# Altium schematic sheet CTR_UVOV.SchDoc: Power Input
size A4; DrawnBy: Andrei Divinagracia; Revision: 0A; SheetNumber: 3; SheetTotal: 10
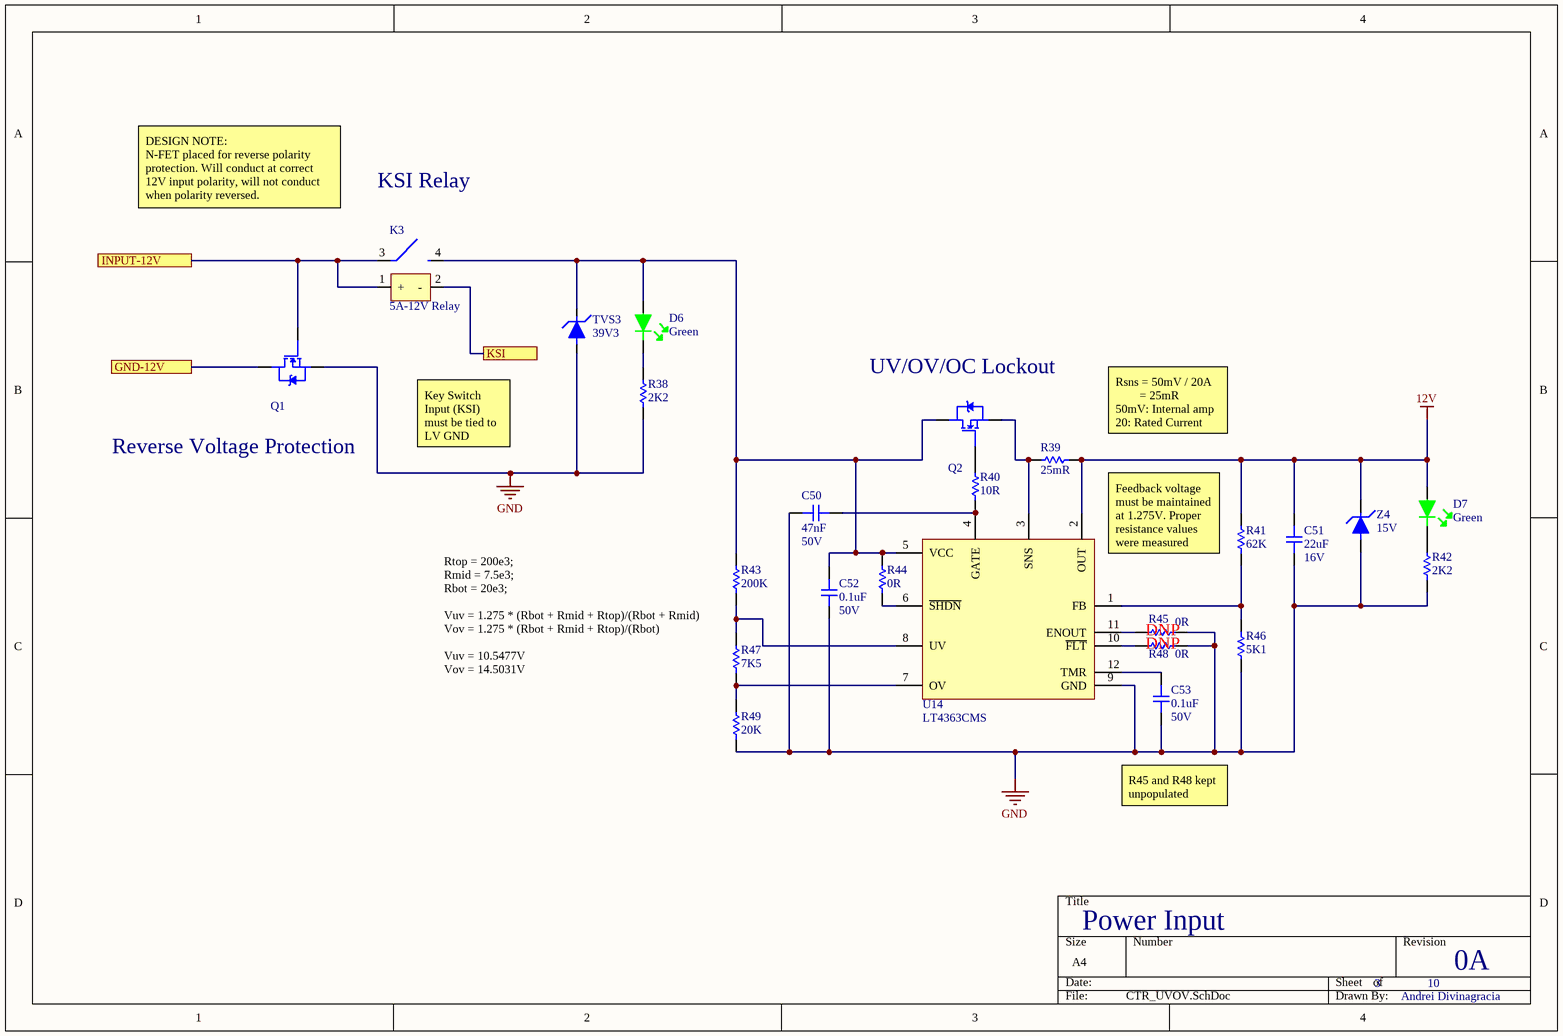
[diagram p0: CTR_UVOV.SchDoc]

## Parts
C50  47nF  Voltage: 50V  [CAP-0805]
C51  22uF  Voltage Rating: 16V  [CAP-0805]
C52  0.1uF  Voltage Rating: 50V  [CAP-0603]
C53  0.1uF  Voltage Rating: 50V  [CAP-0603]
D6  Green  [LED-0603]
D7  Green  [LED-0603]
K3  5A-12V Relay  [Relay]
Q1  DMN6040SK3-13  [TO-252-3]  (value not drawn)
Q2  DMN6040SK3-13  [TO-252-3]  (value not drawn)
R38  2K2  [RES-0603]
R39  25mR  [RES-2512]
R40  10R  [RES-0603]
R41  62K  [RES-0603]
R42  2K2  [RES-0603]
R43  200K  [RES-0603]
R44  0R  [RES-0603]
R45  0R  [RES-0603]
R46  5K1  [RES-0603]
R47  7K5  [RES-0603]
R48  0R  [RES-0603]
R49  20K  [RES-0603]
TVS3  39V3  [DO-214AC]
U14  LT4363CMS  [SSOP12-UVOV]
Z4  15V  [DO-214AC]

## Ports
GND-12V, INPUT-12V, KSI

## Nets
12V: C51.2 D7.1 R39.1 R41.2 U14.2(OUT) Z4.1
GND: C50.1 C51.1 C52.1 C53.1 Q1.3(S) R38.1 R42.1 R45.1 R46.2 R48.1 R49.1 TVS3.2 U14.9(GND) Z4.2
GND-12V: Q1.2(D) ; port GND-12V
INPUT-12V: K3.1(+) K3.3 Q1.1(G) ; port INPUT-12V
KSI: K3.2(-) ; port KSI
NetC50_2: C50.2 R40.1 U14.4(GATE)
NetC52_2: C52.2 D6.1 K3.4 Q2.2(D) R43.2 R44.2 TVS3.1 U14.5(VCC)
NetC53_2: C53.2 U14.12(TMR)
NetD6_2: D6.2 R38.2
NetD7_2: D7.2 R42.2
NetQ2_1: Q2.1(G) R40.2
NetQ2_3: Q2.3(S) R39.2 U14.3(SNS)
NetR41_1: R41.1 R46.1 U14.1(FB)
NetR43_1: R43.1 R47.2 U14.8(UV)
NetR44_1: R44.1 U14.6(~{SHDN})
NetR45_2: R45.2 U14.11(ENOUT)
NetR47_1: R47.1 R49.2 U14.7(OV)
NetR48_2: R48.2 U14.10(~{FLT})

## Notes on the sheet
- DESIGN NOTE:
  N-FET placed for reverse polarity protection. Will conduct at correct 12V input polarity, will not conduct when polarity reversed.
- KSI Relay
- (near Q2) UV/OV/OC Lockout
- Key Switch Input (KSI) must be tied to LV GND
- (near R39) Rsns = 50mV / 20A
  = 25mR
  50mV: Internal amp
  20: Rated Current
- Reverse Voltage Protection
- Feedback voltage must be maintained at 1.275V. Proper resistance values were measured
- (near R45) DNP
- DNP
- Rtop = 200e3;
  Rmid = 7.5e3;
  Rbot = 20e3;
  Vuv = 1.275 * (Rbot + Rmid + Rtop)/(Rbot + Rmid)
  Vov = 1.275 * (Rbot + Rmid + Rtop)/(Rbot)
  Vuv = 10.5477V
  Vov = 14.5031V
- (near C53) R45 and R48 kept unpopulated

## Library data of the parts
C50 = 0805-47nF-50V: CAP CER 0.047UF 50V X7R 0805; Manufacturer: Yageo; Manufacturer Part Number: CC0805KRX7R9BB473; Material: Ceramic; Tolerance: 10%; Insulation Resistance: 100GR; Dissipation Factor: 2.5%; Supplier 1: Digi-Key; Stock 1: 16938; Pricing 1: 1=0.14, 10=0.1, 100=0.047, 500=0.03298, 1000=0.0273 (USD); Mount: Surface Mount; Case/Package: 0805; Number of Pins: 2; Case Code (Metric): 2012; Case Code (Imperial): 0805; Dielectric Material: Ceramic; Min Operating Temperature: -55°C; Max Operating Temperature: 125°C; Packaging: Tape and Reel; Capacitance: 47nF; Voltage Rating: 50V; Package Quantity: 1; Voltage Rating (DC): 50V; Dielectric: X7R; Termination: SMD/SMT; Composition: Ceramic; Length: 2mm; Height: 1.25mm; Width: 1.25mm; Thickness: 0.037inch; Depth: 1.25mm; Radiation Hardening: No; REACH SVHC: Unknown; Lead Free: Lead Free; Halogen Free: Halogen Free; ComponentLink1URL: http://www.yageo.com/documents/recent/UPY-GPHC_X7R_6.3V-to-50V_18.pdf?src-supplier=Digi-Key; ComponentLink1Description: http://www.yageo.com/documents/recent/UPY-GPHC_X7R_6.3V-to-50V_18.pdf?src-supplier=Digi-Key; ComponentLink2URL: http://www.farnell.com/datasheets/2167236.pdf?src-supplier=Element14; ComponentLink2Description: http://www.farnell.com/datasheets/2167236.pdf?src-supplier=Element14; ComponentLink3URL: http://www.farnell.com/datasheets/1489800.pdf?src-supplier=Element14; ComponentLink3Description: http://www.farnell.com/datasheets/1489800.pdf?src-supplier=Element14; ComponentLink4URL: http://www.yageo.com/documents/recent/UPY-GPHC_X7R_6.3V-to-50V_8.pdf?src-supplier=Avnet; ComponentLink4Description: http://www.yageo.com/documents/recent/UPY-GPHC_X7R_6.3V-to-50V_8.pdf?src-supplier=Avnet; ComponentLink5URL: https://www.verical.com/server-webapp/html/getDatasheet?partID=403708&src-supplier=Verical; ComponentLink5Description: https://www.verical.com/server-webapp/html/getDatasheet?partID=403708&src-supplier=Verical; Supplier Part Number 1: 311-1431-6-ND
C51 = CL21A226KOQNNNE: CAP CER 22UF 16V X5R 0805; Manufacturer: Samsung; Tolerance: 10%; Supplier 1: Digi-Key; Manufacturer Part Number: CL21A226KOQNNNE; Stock 1: 761343; Pricing 1: 1=0.37, 10=0.258, 50=0.1804, 100=0.1546, 500=0.11592, 1000=0.09789 (USD); Mount: Surface Mount; Case/Package: 0805; Case Code (Metric): 2012; Case Code (Imperial): 0805; Min Operating Temperature: -55°C; Max Operating Temperature: 85°C; Packaging: Tape and Reel; Capacitance: 22uF; Voltage Rating (DC): 16V; Length: 0.079inch; Width: 0.049inch; Thickness: 0.055inch; Lead Free: Lead Free; RoHS Compliant: Yes; ComponentLink1URL: http://www.samsungsem.com/kr/support/library/product-catalog/mlcc.jsp?src-supplier=Digi-Key; ComponentLink1Description: http://www.samsungsem.com/kr/support/library/product-catalog/mlcc.jsp?src-supplier=Digi-Key; Supplier Part Number 1: 1276-6526-6-ND
C52 C53 = 0603-0.1uF-50V: CAP CER 0.1UF 50V X7R 0603; Manufacturer: Samsung; Manufacturer Part Number: CL10B104KB8NNNL; Capacitance: 100nF; Tolerance: 10%; Supplier 1: Digi-Key; Stock 1: 1355979; Pricing 1: 1=0.1, 10=0.03, 50=0.0164, 100=0.0134, 500=0.00958, 1000=0.00753, 2500=0.00684, 5000=0.0063 (USD); Mount: Surface Mount; Case/Package: 0603; Min Operating Temperature: -55°C; Max Operating Temperature: 125°C; Packaging: Tape and Reel; Package Quantity: 15000; Dielectric: X7R; Voltage Rating (DC): 50V; Series: CL; Construction: Flat; Length: 1.6mm; Width: 0.031inch; Height: 0.8mm; Thickness: 0.035inch; Depth: 0.8mm; Radiation Hardening: No; RoHS Compliant: Yes; ComponentLink1URL: https://www.verical.com/server-webapp/html/getDatasheet?partID=357523&src-supplier=Verical; ComponentLink1Description: https://www.verical.com/server-webapp/html/getDatasheet?partID=357523&src-supplier=Verical; ComponentLink2URL: https://media.digikey.com/pdf/Data%20Sheets/Samsung%20PDFs/CL_Series_MLCC_ds.pdf?src-supplier=Digi-Key; ComponentLink2Description: https://media.digikey.com/pdf/Data%20Sheets/Samsung%20PDFs/CL_Series_MLCC_ds.pdf?src-supplier=Digi-Key; Supplier Part Number 1: 1276-CL10B104KB8NNNLCT-ND
D6 D7 = LED-Green: LED GREEN CLEAR 0603 SMD; Manufacturer: Wurth Electronics; Manufacturer Part Number: 150060VS75000; Luminous Intensity: 40mcd; Viewing Angle: 140°; Forward Voltage: 2V; Wavelength: 570nm; Lens Style: Clear,Rectangular; Forward Current: 30mA; Test Current: 20mA; Supplier 1: Digi-Key; Stock 1: 118118; Pricing 1: 1=0.14, 50=0.133, 100=0.114, 500=0.099 (USD); Mount: Surface Mount; Case/Package: 0603; Number of Pins: 2; Color: Green; Case Code (Metric): 1608; Case Code (Imperial): 0603; Min Operating Temperature: -40°C; Max Operating Temperature: 85°C; Package Quantity: 1; Packaging: Tape and Reel; Dominant Wavelength: 570nm; Length: 1.6mm; Height: 0.7mm; Width: 0.8mm; REACH SVHC: Unknown; ComponentLink1URL: https://katalog.we-online.de/led/datasheet/150060VS75000.pdf?src-supplier=Digi-Key; ComponentLink1Description: https://katalog.we-online.de/led/datasheet/150060VS75000.pdf?src-supplier=Digi-Key; Supplier Part Number 1: 732-4980-1-ND
K3 = OJE-SH-112DM,000: General Purpose Relay SPST-NO (1 Form A) 12VDC Coil Through Hole; Manufacturer: TE Connectivity; Contact Current Rating: 5A; Coil Current: 37.5mA; Throw Configuration: SPST; Operate Time: 10ms; Release Time: 4ms; Coil Power: 500mW; Coil Resistance: 320R; Coil Type: Non-Latching; Coil Voltage (DC): 12V; Contact Voltage Rating (DC): 30V; Max Voltage Rating (AC): 265V; Supplier 1: Digi-Key; Manufacturer Part Number: OJE-SH-112DM,000; Stock 1: 912; Pricing 1: 1=1.18, 10=1.105, 25=0.9824, 50=0.9334, 100=0.8843, 250=0.78608, 500=0.73696, 1000=0.68782, 5000=0.66326 (USD); Mount: Through Hole; Number of Pins: 4; Contact Material: Silver; Weight: 9g; Min Operating Temperature: -30°C; Max Operating Temperature: 85°C; Package Quantity: 100; Packaging: Tray; Termination: PCB; Relay Type: General Purpose; Series: OJE, OEG; Max Voltage Rating (DC): 30V; Length: 0.717inch; Width: 0.4inch; Height: 14.7mm; RoHS Compliant: Yes; REACH SVHC: Unknown; Lead Free: Lead Free; ComponentLink1URL: http://www.farnell.com/datasheets/1846831.pdf?src-supplier=Farnell; ComponentLink1Description: http://www.farnell.com/datasheets/1846831.pdf?src-supplier=Farnell; ComponentLink2URL: http://www.onlinecomponents.com/productFiles/mf-PB/ojojeseries.pdf?src-supplier=Onlinecomponents.com; ComponentLink2Description: http://www.onlinecomponents.com/productFiles/mf-PB/ojojeseries.pdf?src-supplier=Onlinecomponents.com; Supplier Part Number 1: PB875-ND
Q1 Q2 = DMN6040SK3-13: MOSFET N CH 60V 20A TO252; Manufacturer: Diodes; Input Capacitance: 1.287nF; Max Power Dissipation: 42W; Rise Time: 8.1ns; Rds On Max: 40mR; Number of Channels: 1; Drain to Source Resistance: 30mR; Turn-On Delay Time: 6.6ns; Turn-Off Delay Time: 20.1ns; Fall Time: 4ns; Element Configuration: Single; Gate to Source Voltage (Vgs): 20V; FET Type: 1 N-Channel; Polarity: N-CHANNEL; Supplier 1: Digi-Key; Manufacturer Part Number: DMN6040SK3-13; Stock 1: 2500; Pricing 1: 1=0.67, 10=0.573, 25=0.5344, 100=0.4275, 500=0.3359, 1000=0.25956 (USD); Mount: Surface Mount; Case/Package: TO-252-3; Number of Pins: 3; Weight: 0.139332oz; Min Operating Temperature: -55°C; Max Operating Temperature: 150°C; Packaging: Tape and Reel; Package Quantity: 2500; Drain to Source Voltage (Vdss): 60V; Continuous Drain Current (ID): 20A; Series: -; Length: 6.7mm; Width: 6.2mm; Height: 2.39mm; Radiation Hardening: No; REACH SVHC: No SVHC; Lead Free: Lead Free; RoHS Compliant: Yes; ComponentLink1URL: http://www.mouser.com/ds/2/115/DMN6040SK3-247263.pdf?src-supplier=Mouser; ComponentLink1Description: http://www.mouser.com/ds/2/115/DMN6040SK3-247263.pdf?src-supplier=Mouser; ComponentLink2URL: http://uk.rs-online.com/webdocs/1268/0900766b81268cd0.pdf?src-supplier=RSComponents; ComponentLink2Description: http://uk.rs-online.com/webdocs/1268/0900766b81268cd0.pdf?src-supplier=RSComponents; ComponentLink3URL: http://www.diodes.com/datasheets/DMN6040SK3.pdf?src-supplier=Avnet; ComponentLink3Description: http://www.diodes.com/datasheets/DMN6040SK3.pdf?src-supplier=Avnet; ComponentLink4URL: https://www.diodes.com/assets/Datasheets/DMN6040SK3.pdf?src-supplier=Digi-Key; ComponentLink4Description: https://www.diodes.com/assets/Datasheets/DMN6040SK3.pdf?src-supplier=Digi-Key; Supplier Part Number 1: DMN6040SK3-13DICT-ND
R38 R42 = 0603-2K2: RES SMD 2.2K OHM 5% 1/10W 0603; Manufacturer: Yageo; Manufacturer Part Number: AC0603JR-072K2L; Resistance: 2.2kR; Power Rating: 100mW; Voltage Rating: 50V; Temperature Coefficient: 100ppm/°C; Supplier 1: Digi-Key; Stock 1: 107229; Pricing 1: 1=0.1, 10=0.024, 100=0.0097, 1000=0.00436, 2500=0.00378 (USD); Case/Package: 0603; Case Code (Imperial): 0603; Case Code (Metric): 1608; Contact Plating: Tin,Matte; Min Operating Temperature: -55°C; Max Operating Temperature: 155°C; Tolerance: 5%; Packaging: Tape and Reel; Resistor Type: Thick Film; Termination: SMD/SMT; Number of Terminations: 2; Max Power Dissipation: 100mW; Features: Moisture Resistant,Automotive AEC-Q200; Series: AC; Length: 0.063inch; Width: 0.8mm; Height: 0.022inch; Radiation Hardening: No; Lead Free: Lead Free; RoHS Compliant: Yes; ComponentLink1URL: http://www.mouser.com/ds/2/447/yageodocoutput-1111992.pdf?src-supplier=Mouser; ComponentLink1Description: http://www.mouser.com/ds/2/447/yageodocoutput-1111992.pdf?src-supplier=Mouser; ComponentLink2URL: http://www.yageo.com/documents/recent/PYu-AC_51_RoHS_L_2_revised.pdf?src-supplier=Avnet+Europe; ComponentLink2Description: http://www.yageo.com/documents/recent/PYu-AC_51_RoHS_L_2_revised.pdf?src-supplier=Avnet+Europe; ComponentLink3URL: http://www.yageo.com/NewPortal/yageodocoutput?fileName=/pdf/R-Chip/PYu-AC_51_RoHS_L_6.pdf&src-supplier=Digi-Key; ComponentLink3Description: http://www.yageo.com/NewPortal/yageodocoutput?fileName=/pdf/R-Chip/PYu-AC_51_RoHS_L_6.pdf&src-supplier=Digi-Key; ComponentLink4URL: https://www.yageo.com/upload/media/product/productsearch/datasheet/rchip/PYu-AC_51_RoHS_L_7.pdf?src-supplier=Digi-Key; ComponentLink4Description: https://www.yageo.com/upload/media/product/productsearch/datasheet/rchip/PYu-AC_51_RoHS_L_7.pdf?src-supplier=Digi-Key; Supplier Part Number 1: YAG3657CT-ND
R39 = 2512-25mR-SHUNT: RES SMD 25 MOHM 1% 2W 2512; Manufacturer: Riedon; Manufacturer Part Number: CSR2512A0R025F; Temperature Coefficient: 50ppm/°C; Supplier 1: Digi-Key; Stock 1: 10830; Pricing 1: 1=0.63, 10=0.525, 25=0.45, 50=0.405, 100=0.3525, 250=0.315, 500=0.255, 1000=0.20625 (USD); Case/Package: 2512; Case Code (Metric): 6432; Case Code (Imperial): 2512; Min Operating Temperature: -55°C; Max Operating Temperature: 170°C; Packaging: Tape and Reel; Resistance: 25mR; Resistor Type: Metal Element; Number of Terminations: 2; Tolerance: 1%; Max Power Dissipation: 2W; Length: 0.252inch; Width: 0.126inch; Height: 0.035inch; ComponentLink1URL: https://riedon.com/media/pdf-tech/riedon_brochure_download.pdf?src-supplier=Digi-Key; ComponentLink1Description: https://riedon.com/media/pdf-tech/riedon_brochure_download.pdf?src-supplier=Digi-Key; ComponentLink2URL: https://riedon.com/media/pdf/CSR.pdf?src-supplier=Digi-Key; ComponentLink2Description: https://riedon.com/media/pdf/CSR.pdf?src-supplier=Digi-Key; Supplier Part Number 1: 696-1666-1-ND
R40 = 0603-10R: RES SMD 10 OHM 1% 1/10W 0603; Manufacturer: Yageo; Manufacturer Part Number: RC0603FR-0710RL; Voltage Rating (DC): 50V; Temperature Coefficient: 200ppm/°C; Power Rating: 100mW; Supplier 1: Digi-Key; Stock 1: 11151092; Pricing 1: 1=0.1, 10=0.046, 100=0.0187, 1000=0.0084, 2500=0.00729 (USD); Case/Package: 0603; Number of Pins: 2; Case Code (Imperial): 0603; Case Code (Metric): 1608; Contact Plating: Tin,Matte; Min Operating Temperature: -55°C; Max Operating Temperature: 155°C; Packaging: Tape and Reel; Resistance: 10R; Tolerance: 1%; Composition: Thick Film; Voltage Rating: 50V; Termination: SMD/SMT; Military Standard: Not; Length: 1.6mm; Height: 0.45mm; Width: 0.8mm; Depth: 0.8mm; Radiation Hardening: No; REACH SVHC: No SVHC; Lead Free: Lead Free; ComponentLink1URL: http://www.farnell.com/datasheets/1868787.pdf?src-supplier=Element14; ComponentLink1Description: http://www.farnell.com/datasheets/1868787.pdf?src-supplier=Element14; ComponentLink2URL: http://www.yageo.com/documents/recent/PYu-RC0603_51_RoHS_L_4.pdf?src-supplier=Avnet; ComponentLink2Description: http://www.yageo.com/documents/recent/PYu-RC0603_51_RoHS_L_4.pdf?src-supplier=Avnet; ComponentLink3URL: http://documents.rs-components.com/techlib://itc_doclist_GB.htm?stockno=5048984&src-supplier=RSComponents; ComponentLink3Description: http://documents.rs-components.com/techlib://itc_doclist_GB.htm?stockno=5048984&src-supplier=RSComponents; ComponentLink4URL: http://www.yageo.com/documents/recent/PYu-RC0603_51_RoHS_L_4.pdf?src-supplier=Avnet+Europe; ComponentLink4Description: http://www.yageo.com/documents/recent/PYu-RC0603_51_RoHS_L_4.pdf?src-supplier=Avnet+Europe; Supplier Part Number 1: 311-10.0HRDKR-ND
R41 = 0603-62K: RES SMD 62K OHM 1% 1/4W 0603; Manufacturer: Panasonic; Manufacturer Part Number: ERJ-PA3F6202V; Power Rating: 250mW; Resistance: 62kR; Voltage Rating: 150V; Temperature Coefficient: 100ppm/°C; Supplier 1: Digi-Key; Stock 1: 17832; Pricing 1: 1=0.15, 10=0.13, 100=0.05, 1000=0.02201, 2500=0.01901 (USD); Mount: Surface Mount; Case/Package: 0603; Case Code (Metric): 1608; Case Code (Imperial): 0603; Min Operating Temperature: -55°C; Max Operating Temperature: 155°C; Tolerance: 1%; Resistor Type: Thick Film; Packaging: Cut Tape; Number of Terminations: 2; Termination: Solder; Max Power Dissipation: 250mW; Voltage Rating (DC): 150V; Features: Automotive AEC-Q200; Length: 0.063inch; Width: 0.031inch; Height: 0.018inch; Depth: 0.8mm; REACH SVHC: No SVHC; ComponentLink1URL: http://www.farnell.com/datasheets/2059624.pdf?src-supplier=Farnell; ComponentLink1Description: http://www.farnell.com/datasheets/2059624.pdf?src-supplier=Farnell; ComponentLink2URL: http://www.farnell.com/datasheets/1801181.pdf?src-supplier=Element14; ComponentLink2Description: http://www.farnell.com/datasheets/1801181.pdf?src-supplier=Element14; Supplier Part Number 1: P62KBYCT-ND
R43 = 0603-200KR: RES SMD 200K OHM 1% 1/10W 0603; Manufacturer: Yageo; Manufacturer Part Number: AF0603FR-07200KL; Max Power Dissipation: 100mW; Temperature Coefficient: 100ppm/°C; Resistance: 200kR; Supplier 1: Digi-Key; Stock 1: 4721; Pricing 1: 1=0.1, 10=0.061, 100=0.0247, 1000=0.01109, 2500=0.00963 (USD); Case/Package: 0603; Min Operating Temperature: -55°C; Max Operating Temperature: 155°C; Packaging: Tape and Reel; Resistor Type: Thick Film; Number of Terminations: 2; Tolerance: 1%; Features: Moisture Resistant,Anti-Sulfur; Length: 0.063inch; Width: 0.031inch; Height: 0.022inch; RoHS Compliant: Yes; ComponentLink1URL: http://www.yageo.com/documents/recent/PYu-AF_51_RoHS_L_5.pdf?src-supplier=Digi-Key; ComponentLink1Description: http://www.yageo.com/documents/recent/PYu-AF_51_RoHS_L_5.pdf?src-supplier=Digi-Key; Supplier Part Number 1: 13-AF0603FR-07200KLDKR-ND
R44 R45 R48 = 0603-0R: RES SMD 0 OHM JUMPER 1/10W 0603; Manufacturer: Yageo; Manufacturer Part Number: RC0603JR-070RL; Resistance: 0mR; Tolerance: 1%; Voltage Rating: 50V; Power Rating: 100mW; Temperature Coefficient: 200ppm/°C; Supplier 1: Digi-Key; Stock 1: 25658294; Pricing 1: 1=0.1, 10=0.019, 25=0.0136, 50=0.0104, 100=0.0077, 250=0.00588, 500=0.00472, 1000=0.00347 (USD); Case/Package: 0603; Number of Pins: 2; Case Code (Imperial): 0603; Case Code (Metric): 1608; Contact Plating: Tin,Matte; Min Operating Temperature: -55°C; Max Operating Temperature: 155°C; Package Quantity: 5000; Packaging: Tape and Reel; Voltage Rating (DC): 50V; Termination: SMD/SMT; Composition: Thick Film; Military Standard: Not; Length: 1.6mm; Height: 0.45mm; Width: 0.8mm; Depth: 0.8mm; Radiation Hardening: No; REACH SVHC: No SVHC; Lead Free: Lead Free; ComponentLink1URL: http://www.farnell.com/datasheets/2167052.pdf?src-supplier=Element14; ComponentLink1Description: http://www.farnell.com/datasheets/2167052.pdf?src-supplier=Element14; ComponentLink2URL: https://www.verical.com/server-webapp/html/getDatasheet?partID=329462&src-supplier=Verical; ComponentLink2Description: https://www.verical.com/server-webapp/html/getDatasheet?partID=329462&src-supplier=Verical; ComponentLink3URL: http://www.yageo.com/documents/recent/PYu-RC_Group_51_RoHS_L_9.pdf?src-supplier=Mouser; ComponentLink3Description: http://www.yageo.com/documents/recent/PYu-RC_Group_51_RoHS_L_9.pdf?src-supplier=Mouser; ComponentLink4URL: http://www.farnell.com/datasheets/443971.pdf?src-supplier=Element14; ComponentLink4Description: http://www.farnell.com/datasheets/443971.pdf?src-supplier=Element14; ComponentLink5URL: http://documents.rs-components.com/techlib://itc_doclist_GB.htm?stockno=6515918&src-supplier=RSComponents; ComponentLink5Description: http://documents.rs-components.com/techlib://itc_doclist_GB.htm?stockno=6515918&src-supplier=RSComponents; Supplier Part Number 1: 311-0.0GRCT-ND
R46 = 0603-5.1KR: RES SMD 5.1K OHM 1% 1/10W 0603; Manufacturer: TE Connectivity; Manufacturer Part Number: 1623257-1; Resistance: 5.1kR; Power Rating: 125mW; Temperature Coefficient: 100ppm/°C; Mount: Surface Mount; Case/Package: 0805; Min Operating Temperature: -55°C; Max Operating Temperature: 125°C; Packaging: Tape and Reel; Tolerance: 1%; Package Quantity: 5000; Resistor Type: Thick Film; Number of Terminations: 2; Series: CRG, Neohm; Max Power Dissipation: 125mW; Construction: Rectangular; Length: 2mm; Width: 0.049inch; Height: 0.026inch; Depth: 1.25mm; Radiation Hardening: No; RoHS Compliant: Yes; Military Standard: Not; ComponentLink1URL: http://www.te.com/commerce/DocumentDelivery/DDEController?Action=showdoc&DocId=Data+Sheet%7F1773204%7FF%7Fpdf%7FEnglish%7FENG_DS_1773204_F.pdf&src-supplier=Avnet+Europe; ComponentLink1Description: http://www.te.com/commerce/DocumentDelivery/DDEController?Action=showdoc&DocId=Data+Sheet%7F1773204%7FF%7Fpdf%7FEnglish%7FENG_DS_1773204_F.pdf&src-supplier=Avnet+Europe; ComponentLink2URL: http://www.te.com/commerce/DocumentDelivery/DDEController?Action=srchrtrv&DocNm=1773204&DocType=DS&DocLang=English&src-supplier=Digi-Key; ComponentLink2Description: http://www.te.com/commerce/DocumentDelivery/DDEController?Action=srchrtrv&DocNm=1773204&DocType=DS&DocLang=English&src-supplier=Digi-Key; ComponentLink3URL: http://www.onlinecomponents.com/productFiles/mf-AMP/eng_ds_1773204_e.pdf?src-supplier=Onlinecomponents.com; ComponentLink3Description: http://www.onlinecomponents.com/productFiles/mf-AMP/eng_ds_1773204_e.pdf?src-supplier=Onlinecomponents.com; Supplier 1: Digi-Key; Supplier Part Number 1: YAG3621CT-ND
R47 = 0603-7K5: RES SMD 7.5K OHM 5% 1/10W 0603; Manufacturer: Yageo; Manufacturer Part Number: RC0603JR-077K5L; Resistance: 7.5kR; Power Rating: 100mW; Voltage Rating: 50V; Temperature Coefficient: 100ppm/°C; Supplier 1: Digi-Key; Stock 1: 191420; Pricing 1: 1=0.1, 10=0.02, 100=0.008, 1000=0.0036, 2500=0.00312 (USD); Case/Package: 0603; Number of Pins: 2; Case Code (Imperial): 0603; Case Code (Metric): 1608; Size Code: 0603; Min Operating Temperature: -55°C; Max Operating Temperature: 155°C; Tolerance: 5%; Packaging: Tape and Reel; Package Quantity: 5000; Termination: SMD/SMT; Resistor Type: Thick Film; Voltage Rating (DC): 50V; Features: Moisture Resistant; Series: RC; Max Power Dissipation: 100mW; Number of Terminations: 2; Construction: Rectangular; Resistance Tolerance: 5%; Length: 1.6mm; Width: 0.8mm; Height: 0.45mm; Depth: 0.8mm; Military Standard: Not; Lead Free: Lead Free; RoHS Compliant: Yes; REACH SVHC: Unknown; ComponentLink1URL: http://www.mouser.com/catalog/specsheets/RC0603.pdf?src-supplier=Mouser; ComponentLink1Description: http://www.mouser.com/catalog/specsheets/RC0603.pdf?src-supplier=Mouser; Supplier Part Number 1: 311-7.5KGRCT-ND
R49 = 0603-20K: RES SMD 20K OHM 5% 1/10W 0603; Manufacturer: Yageo; Manufacturer Part Number: RC0603JR-0720KL; Resistance: 20kR; Power Rating: 100mW; Voltage Rating: 50V; Temperature Coefficient: 100ppm/°C; Supplier 1: Digi-Key; Stock 1: 1558181; Pricing 1: 1=0.1, 10=0.02, 100=0.008, 1000=0.0036, 2500=0.00312 (USD); Case/Package: 0603; Number of Pins: 2; Case Code (Metric): 1608; Case Code (Imperial): 0603; Size Code: 0603; Min Operating Temperature: -55°C; Max Operating Temperature: 155°C; Tolerance: 5%; Packaging: Tape and Reel; Resistor Type: Thick Film; Number of Terminations: 2; Termination: SMD/SMT; Max Power Dissipation: 100mW; Voltage Rating (DC): 50V; Features: Moisture Resistant; Series: RC; Resistance Tolerance: 5%; Construction: Rectangular; Package Quantity: 1; Length: 0.063inch; Width: 0.031inch; Height: 0.022inch; Depth: 0.8mm; REACH SVHC: No SVHC; Military Standard: Not; Lead Free: Lead Free; RoHS Compliant: Yes; ComponentLink1URL: http://www.farnell.com/datasheets/443971.pdf?src-supplier=Element14; ComponentLink1Description: http://www.farnell.com/datasheets/443971.pdf?src-supplier=Element14; ComponentLink2URL: http://www.yageo.com/documents/recent/PYu-RC_Group_51_RoHS_L_10.pdf?src-supplier=Digi-Key; ComponentLink2Description: http://www.yageo.com/documents/recent/PYu-RC_Group_51_RoHS_L_10.pdf?src-supplier=Digi-Key; Supplier Part Number 1: 311-20KGRCT-ND
TVS3 = SMAJ18CA-TR-Bi: TVS DIODE 18VWM 39.3VC SMA; Manufacturer: STMicroelectronics; Direction: Bidirectional; Reverse Breakdown Voltage: 20V; Operating Supply Voltage: 18V; Capacitance: 800pF; Max Surge Current: 13.7A; Number of Elements: 1; Clamping Voltage: 39.3V; Peak Pulse Power: 400W; Power Line Protection: No; Breakdown Voltage: 21.1V; Peak Pulse Current: 59A; Test Current: 1mA; ESD Protection: Yes; Max Reverse Leakage Current: 200nA; Max Power Dissipation: 3.3W; Element Configuration: Single; Diode Type: ZENER; Supplier 1: Digi-Key; Manufacturer Part Number: SMAJ18CA-TR; Stock 1: 8232; Pricing 1: 1=0.38, 10=0.311, 100=0.2117, 500=0.15874, 1000=0.11906, 2000=0.1092 (USD); Mount: Surface Mount; Case/Package: SMA; Number of Pins: 2; Min Operating Temperature: -55°C; Max Operating Temperature: 150°C; Packaging: Tape and Reel; Package Quantity: 1; Number of Bidirectional Channels: 1; Reverse Standoff Voltage: 18V; Min Breakdown Voltage: 20V; Number of Channels: 1; Polarity: Bidirectional; Termination: SMD/SMT; Max Breakdown Voltage: 21.1V; Power Dissipation: 400W; Leakage Current: 200nA; Voltage Rating (DC): 18V; Resistor Type: Zener; Series: SMAJ, TRANSIL™; Clamping Voltage-Max: 39.3V; Length: 4.6mm; Width: 2.9mm; Height: 2.45mm; Radiation Hardening: No; REACH SVHC: No SVHC; Lead Free: Lead Free; RoHS Compliant: Yes; ComponentLink1URL: http://www.farnell.com/datasheets/1724007.pdf?src-supplier=Element14; ComponentLink1Description: http://www.farnell.com/datasheets/1724007.pdf?src-supplier=Element14; ComponentLink2URL: http://www.st.com/content/ccc/resource/technical/document/datasheet/ff/c0/80/cc/19/4c/45/af/CD00001333.pdf/files/CD00001333.pdf/_jcr_content/translations/en.CD00001333.pdf?src-supplier=Digi-Key; ComponentLink2Description: http://www.st.com/content/ccc/resource/technical/document/datasheet/ff/c0/80/cc/19/4c/45/af/CD00001333.pdf/files/CD00001333.pdf/_jcr_content/translations/en.CD00001333.pdf?src-supplier=Digi-Key; ComponentLink3URL: http://www.mouser.com/ds/2/389/smaj-955168.pdf?src-supplier=Mouser; ComponentLink3Description: http://www.mouser.com/ds/2/389/smaj-955168.pdf?src-supplier=Mouser; ComponentLink4URL: http://www.st.com/web/en/resource/technical/document/datasheet/CD00001333.pdf?src-supplier=Future+Electronics; ComponentLink4Description: http://www.st.com/web/en/resource/technical/document/datasheet/CD00001333.pdf?src-supplier=Future+Electronics; ComponentLink5URL: https://www.verical.com/server-webapp/html/getDatasheet?partID=83400&src-supplier=Verical; ComponentLink5Description: https://www.verical.com/server-webapp/html/getDatasheet?partID=83400&src-supplier=Verical; ComponentLink6URL: http://www.produktinfo.conrad.com/datenblaetter/1100000-1199999/001184239-da-01-en-TRANSIL_400W_18_SMAJ18CA_TR_DO_214AC_STM.pdf?src-supplier=Conrad; ComponentLink6Description: http://www.produktinfo.conrad.com/datenblaetter/1100000-1199999/001184239-da-01-en-TRANSIL_400W_18_SMAJ18CA_TR_DO_214AC_STM.pdf?src-supplier=Conrad; Supplier Part Number 1: 497-7446-1-ND
U14 = LT4363CMS-2#PBF: IC SURGE STOPPER HV 12-MSOP; Manufacturer: Analog Devices / Linear Technology; Min Supply Voltage: 4V; Max Supply Voltage: 80V; Clamping Voltage: 27V; Number of Circuits: 1; Supplier 1: Digi-Key; Manufacturer Part Number: LT4363CMS-2#PBF; Stock 1: 1060; Pricing 1: 1=6.63, 10=5.954, 25=5.6288, 100=4.8781, 250=4.62796, 500=4.15266, 1000=3.54 (USD); Case/Package: MSOP; Number of Pins: 12; Min Operating Temperature: 0°C; Max Operating Temperature: 70°C; Package Quantity: 37; Packaging: Rail/Tube; Working Voltage: 80V; REACH SVHC: No SVHC; Lead Free: Lead Free; RoHS Compliant: Yes; ComponentLink1URL: http://www.farnell.com/datasheets/1720292.pdf?src-supplier=Farnell; ComponentLink1Description: http://www.farnell.com/datasheets/1720292.pdf?src-supplier=Farnell; ComponentLink2URL: http://www.farnell.com/datasheets/1720292.pdf?src-supplier=Element14; ComponentLink2Description: http://www.farnell.com/datasheets/1720292.pdf?src-supplier=Element14; ComponentLink3URL: http://www.farnell.com/datasheets/1720292.pdf?src-supplier=Newark; ComponentLink3Description: http://www.farnell.com/datasheets/1720292.pdf?src-supplier=Newark; ComponentLink4URL: http://www.farnell.com/datasheets/1563218.pdf?src-supplier=Newark; ComponentLink4Description: http://www.farnell.com/datasheets/1563218.pdf?src-supplier=Newark; ComponentLink5URL: http://www.linear.com/docs/44087?src-supplier=Digi-Key; ComponentLink5Description: http://www.linear.com/docs/44087?src-supplier=Digi-Key; Supplier Part Number 1: LT4363CMS-2#PBF-ND
Z4 = 1SMA5929BT3G: Diode Zener Single 15V 5% 500mW 2-Pin SMA T/R; Manufacturer: ON Semiconductor; Max Power Dissipation: 1.5W; Forward Voltage: 1.5V; Impedance: 9R; Max Reverse Leakage Current: 500nA; Zener Current: 100mA; Test Current: 25mA; Breakdown Voltage: 15.75V; ESD Protection: Yes; Supplier 1: Digi-Key; Manufacturer Part Number: 1SMA5929BT3G; Stock 1: 16404; Pricing 1: 1=0.5, 10=0.374, 100=0.2328, 500=0.1593, 1000=0.12254, 2000=0.11028 (USD); Case/Package: SMA; Number of Pins: 2; Material: Plastic; Contact Plating: Tin,Matte; Min Operating Temperature: -65°C; Max Operating Temperature: 150°C; Tolerance: 5%; Package Quantity: 1; Packaging: Tape and Reel; Zener Voltage: 15V; Voltage Tolerance: 5%; Element Configuration: Single; Power Dissipation: 500mW; Working Voltage: 15V; Max Reverse Current: 500nA; Voltage Rating (DC): 15V; Power Rating: 1.5W; Radiation Hardening: No; Lead Free: Lead Free; Halogen Free: Halogen Free; REACH SVHC: No SVHC; ComponentLink1URL: http://www.jameco.com/Jameco/Products/ProdDS/1307506.pdf?src-supplier=Jameco; ComponentLink1Description: http://www.jameco.com/Jameco/Products/ProdDS/1307506.pdf?src-supplier=Jameco; ComponentLink2URL: http://www.farnell.com/datasheets/86090.pdf?src-supplier=Element14; ComponentLink2Description: http://www.farnell.com/datasheets/86090.pdf?src-supplier=Element14; ComponentLink3URL: http://www.onsemi.com/pub/Collateral/1SMA5913BT3-D.PDF?src-supplier=Avnet; ComponentLink3Description: http://www.onsemi.com/pub/Collateral/1SMA5913BT3-D.PDF?src-supplier=Avnet; ComponentLink4URL: http://www.onsemi.com/pub_link/Collateral/1SMA5913BT3-D.PDF?src-supplier=Future+Electronics; ComponentLink4Description: http://www.onsemi.com/pub_link/Collateral/1SMA5913BT3-D.PDF?src-supplier=Future+Electronics; ComponentLink5URL: https://www.verical.com/server-webapp/html/getDatasheet?partID=92644&src-supplier=Verical; ComponentLink5Description: https://www.verical.com/server-webapp/html/getDatasheet?partID=92644&src-supplier=Verical; ComponentLink6URL: http://www.onsemi.com/pub/Collateral/1SMA5913BT3-D.PDF?src-supplier=Avnet+Europe; ComponentLink6Description: http://www.onsemi.com/pub/Collateral/1SMA5913BT3-D.PDF?src-supplier=Avnet+Europe; ComponentLink7URL: https://www.onsemi.com/pub/Collateral/1SMA5913BT3-D.PDF?src-supplier=Digi-Key; ComponentLink7Description: https://www.onsemi.com/pub/Collateral/1SMA5913BT3-D.PDF?src-supplier=Digi-Key; ComponentLink8URL: http://www.farnell.com/datasheets/1576139.pdf?src-supplier=Element14; ComponentLink8Description: http://www.farnell.com/datasheets/1576139.pdf?src-supplier=Element14; ComponentLink9URL: http://www.mouser.com/ds/2/308/1SMA5913BT3-D-108672.pdf?src-supplier=Mouser; ComponentLink9Description: http://www.mouser.com/ds/2/308/1SMA5913BT3-D-108672.pdf?src-supplier=Mouser; Supplier Part Number 1: 1SMA5929BT3GOSCT-ND